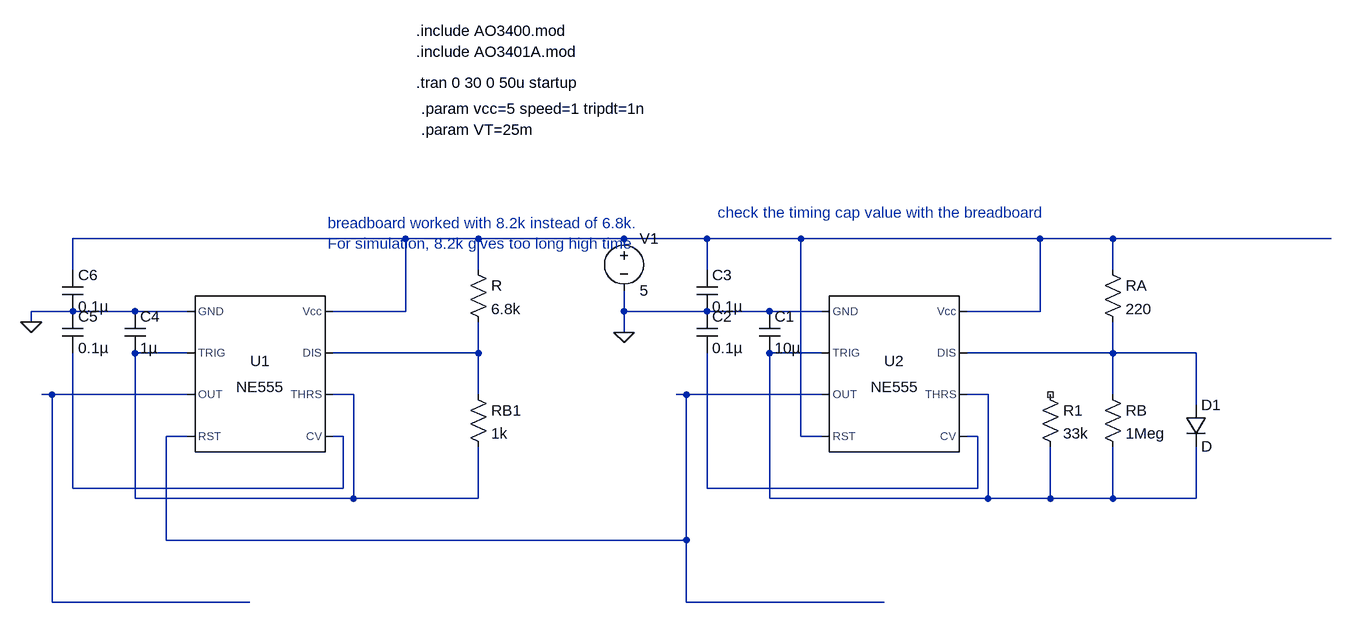
[diagram p0: schematic oscillator_new.asc]
oscillator_new.asc, the LTspice schematic file:
Version 4.1
SHEET 1 1188 836
WIRE -240 -384 -752 -384
WIRE -128 -384 -240 -384
WIRE 96 -384 -128 -384
WIRE 224 -384 96 -384
WIRE 368 -384 224 -384
WIRE 736 -384 368 -384
WIRE 848 -384 736 -384
WIRE 1184 -384 848 -384
WIRE -752 -336 -752 -384
WIRE -128 -336 -128 -384
WIRE 224 -336 224 -384
WIRE 848 -336 848 -384
WIRE -752 -272 -816 -272
WIRE -656 -272 -752 -272
WIRE -576 -272 -656 -272
WIRE -240 -272 -240 -384
WIRE -240 -272 -352 -272
WIRE 96 -272 96 -304
WIRE 224 -272 96 -272
WIRE 320 -272 224 -272
WIRE 400 -272 320 -272
WIRE 736 -272 736 -384
WIRE 736 -272 624 -272
WIRE -816 -256 -816 -272
WIRE 96 -240 96 -272
WIRE -576 -208 -656 -208
WIRE -128 -208 -128 -256
WIRE -128 -208 -352 -208
WIRE 400 -208 320 -208
WIRE 848 -208 848 -256
WIRE 848 -208 624 -208
WIRE 976 -208 848 -208
WIRE -784 -144 -800 -144
WIRE -576 -144 -784 -144
WIRE -320 -144 -352 -144
WIRE -128 -144 -128 -208
WIRE 192 -144 176 -144
WIRE 400 -144 192 -144
WIRE 656 -144 624 -144
WIRE 848 -144 848 -208
WIRE 976 -128 976 -208
WIRE -576 -80 -608 -80
WIRE -336 -80 -352 -80
WIRE 368 -80 368 -384
WIRE 400 -80 368 -80
WIRE 640 -80 624 -80
WIRE -752 0 -752 -208
WIRE -336 0 -336 -80
WIRE -336 0 -752 0
WIRE 224 0 224 -208
WIRE 640 0 640 -80
WIRE 640 0 224 0
WIRE -656 16 -656 -208
WIRE -320 16 -320 -144
WIRE -320 16 -656 16
WIRE -128 16 -128 -64
WIRE -128 16 -320 16
WIRE 320 16 320 -208
WIRE 656 16 656 -144
WIRE 656 16 320 16
WIRE 752 16 752 -64
WIRE 752 16 656 16
WIRE 848 16 848 -64
WIRE 848 16 752 16
WIRE 976 16 976 -64
WIRE 976 16 848 16
WIRE -608 80 -608 -80
WIRE 192 80 192 -144
WIRE 192 80 -608 80
WIRE -784 176 -784 -144
WIRE -480 176 -784 176
WIRE 192 176 192 80
WIRE 496 176 192 176
FLAG 96 -240 0
FLAG -816 -256 0
SYMBOL Misc\\NE555 512 -176 R0
SYMATTR InstName U2
SYMBOL cap 304 -272 R0
SYMATTR InstName C1
SYMATTR Value 10µ
SYMATTR SpiceLine V=10 Irms=1.2 Rser=0.0159 Lser=2.362n
SYMBOL res 832 -160 R0
SYMATTR InstName RB
SYMATTR Value 1Meg
SYMBOL res 832 -352 R0
SYMATTR InstName RA
SYMATTR Value 220
SYMBOL cap 208 -272 R0
SYMATTR InstName C2
SYMATTR Value 0.1µ
SYMATTR SpiceLine V=10 Irms=0 Rser=0.0184 Lser=308p mfg="Würth Elektronik" pn="885012205018 WCAP-CSGP 0402" type="X7R"
SYMBOL cap 208 -336 R0
SYMATTR InstName C3
SYMATTR Value 0.1µ
SYMATTR SpiceLine V=10 Irms=0 Rser=0.0163 Lser=375p mfg="Würth Elektronik" pn="885012207016 WCAP-CSGP 0805" type="X7R"
SYMBOL voltage 96 -400 R0
WINDOW 123 0 0 Left 0
WINDOW 39 0 0 Left 0
SYMATTR InstName V1
SYMATTR Value 5
SYMBOL diode 960 -128 R0
SYMATTR InstName D1
SYMBOL Misc\\NE555 -464 -176 R0
SYMATTR InstName U1
SYMBOL cap -672 -272 R0
SYMATTR InstName C4
SYMATTR Value 1µ
SYMATTR SpiceLine V=10 Irms=1.2 Rser=0.0159 Lser=2.362n
SYMBOL res -144 -160 R0
SYMATTR InstName RB1
SYMATTR Value 1k
SYMBOL res -144 -352 R0
SYMATTR InstName R
SYMATTR Value 6.8k
SYMBOL cap -768 -272 R0
SYMATTR InstName C5
SYMATTR Value 0.1µ
SYMATTR SpiceLine V=10 Irms=0 Rser=0.0184 Lser=308p mfg="Würth Elektronik" pn="885012205018 WCAP-CSGP 0402" type="X7R"
SYMBOL cap -768 -336 R0
SYMATTR InstName C6
SYMATTR Value 0.1µ
SYMATTR SpiceLine V=10 Irms=0 Rser=0.0163 Lser=375p mfg="Würth Elektronik" pn="885012207016 WCAP-CSGP 0805" type="X7R"
SYMBOL res 736 -160 R0
SYMATTR InstName R1
SYMATTR Value 33k
TEXT -224 -704 Left 2 !.include AO3400.mod
TEXT -224 -672 Left 2 !.include AO3401A.mod
TEXT -224 -624 Left 2 !.tran 0 30 0 50u startup
TEXT -216 -584 Left 2 !.param vcc=5 speed=1 tripdt=1n
TEXT -216 -552 Left 2 !.param VT=25m
TEXT 240 -424 Left 2 ;check the timing cap value with the breadboard
TEXT -360 -408 Left 2 ;breadboard worked with 8.2k instead of 6.8k. \nFor simulation, 8.2k gives too long high time.

The netlist it stands for:
* oscillator_new.asc
X§U2 0 N004 N007 N001 N009 N004 N005 N001 NE555  ; pins GND TRIG OUT RST CV THRS DIS Vcc
C1 0 N004 10µ V=10 Irms=1.2 Rser=0.0159 Lser=2.362n
RB N005 N004 1Meg
RA N001 N005 220
C2 0 N009 0.1µ V=10 Irms=0 Rser=0.0184 Lser=308p mfg="Würth Elektronik" pn="885012205018 WCAP-CSGP 0402" type="X7R"
C3 N001 0 0.1µ V=10 Irms=0 Rser=0.0163 Lser=375p mfg="Würth Elektronik" pn="885012207016 WCAP-CSGP 0805" type="X7R"
V1 N001 0 5
D1 N005 N004 D
X§U1 0 N002 N006 N007 N008 N002 N003 N001 NE555  ; pins GND TRIG OUT RST CV THRS DIS Vcc
C4 0 N002 1µ V=10 Irms=1.2 Rser=0.0159 Lser=2.362n
RB1 N003 N002 1k
R N001 N003 6.8k
C5 0 N008 0.1µ V=10 Irms=0 Rser=0.0184 Lser=308p mfg="Würth Elektronik" pn="885012205018 WCAP-CSGP 0402" type="X7R"
C6 N001 0 0.1µ V=10 Irms=0 Rser=0.0163 Lser=375p mfg="Würth Elektronik" pn="885012207016 WCAP-CSGP 0805" type="X7R"
R1 NC_01 N004 33k
.model D D
.lib standard.dio
.include AO3400.mod
.include AO3401A.mod
.tran 0 30 0 50u startup
.param vcc=5 speed=1 tripdt=1n
.param VT=25m
* check the timing cap value with the breadboard
* breadboard worked with 8.2k instead of 6.8k.
* For simulation, 8.2k gives too long high time.
.lib NE555.sub
.backanno
.end